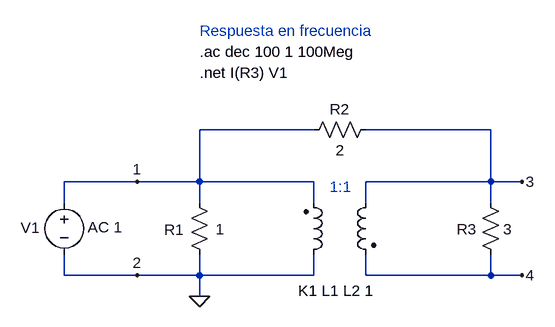
[diagram p0: schematic EJ1.asc]
EJ1.asc, the LTspice schematic file:
Version 4
SHEET 1 880 680
WIRE -448 160 -624 160
WIRE -176 160 -368 160
WIRE -720 240 -832 240
WIRE -624 240 -624 160
WIRE -624 240 -720 240
WIRE -448 240 -624 240
WIRE -176 240 -176 160
WIRE -176 240 -368 240
WIRE -128 240 -176 240
WIRE -832 272 -832 240
WIRE -624 272 -624 240
WIRE -448 272 -448 240
WIRE -368 272 -368 240
WIRE -176 272 -176 240
WIRE -832 384 -832 352
WIRE -720 384 -832 384
WIRE -624 384 -624 352
WIRE -624 384 -720 384
WIRE -448 384 -448 352
WIRE -448 384 -624 384
WIRE -368 384 -368 352
WIRE -176 384 -176 352
WIRE -176 384 -368 384
WIRE -128 384 -176 384
WIRE -624 416 -624 384
FLAG -624 416 0
FLAG -720 240 1
FLAG -720 384 2
FLAG -128 240 3
FLAG -128 384 4
SYMBOL voltage -832 256 R0
WINDOW 123 36 54 Left 2
WINDOW 0 -67 55 Left 2
SYMATTR Value2 AC 1
SYMATTR SpiceLine Rser=0.1
SYMATTR InstName V1
SYMATTR Value ""
SYMBOL res -192 256 R0
WINDOW 0 -36 57 Left 2
WINDOW 3 35 57 Left 2
SYMATTR InstName R3
SYMATTR Value 3
SYMBOL res -640 256 R0
WINDOW 0 -38 58 Left 2
WINDOW 3 41 57 Left 2
SYMATTR InstName R1
SYMATTR Value 1
SYMBOL res -352 144 R90
WINDOW 0 0 56 VBottom 2
WINDOW 3 32 56 VTop 2
SYMATTR InstName R2
SYMATTR Value 2
SYMBOL ind2 -352 256 M0
WINDOW 0 -37 57 Invisible 2
WINDOW 3 -42 70 Invisible 2
SYMATTR InstName L2
SYMATTR Value 1
SYMATTR Type ind
SYMBOL ind2 -464 368 M180
WINDOW 0 -19 43 Invisible 2
WINDOW 3 -31 44 Invisible 2
SYMATTR InstName L1
SYMATTR Value 1
SYMATTR Type ind
TEXT -624 40 Left 2 !.ac dec 100 1 100Meg
TEXT -624 8 Left 2 ;Respuesta en frecuencia
TEXT -624 72 Left 2 !.net I(R3) V1
TEXT -472 408 Left 2 !K1 L1 L2 1
TEXT -424 248 Left 2 ;1:1

The netlist it stands for:
* EJ1.asc
V1 1 0 AC 1 Rser=0.1
R3 3 4 3
R1 1 0 1
R2 3 1 2
L2 3 4 1
L1 0 1 1
.ac dec 100 1 100Meg
* Respuesta en frecuencia
.net I(R3) V1
K1 L1 L2 1
* 1:1
.backanno
.end

* Results of the author's LTspice run, read from the files saved beside the schematic
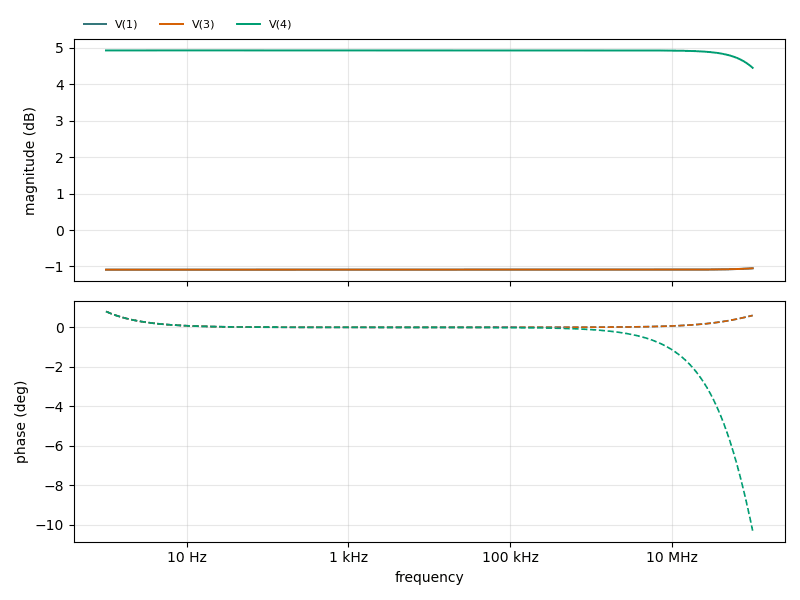
[diagram p1: AC Analysis of EJ1.asc, plotted from the saved traces]
* AC Analysis, 1 run:
*   V(1): -1.09 dB at 1 Hz, -1.05 dB at 100 MHz, peak -1.05 dB at 100 MHz
*   V(3): -1.09 dB at 1 Hz, -1.05 dB at 100 MHz, peak -1.05 dB at 100 MHz
*   V(4): 4.93 dB at 1 Hz, 4.46 dB at 100 MHz, peak 4.93 dB at 1.995 kHz